# Altium project aquasense_boron1.PrjPcb
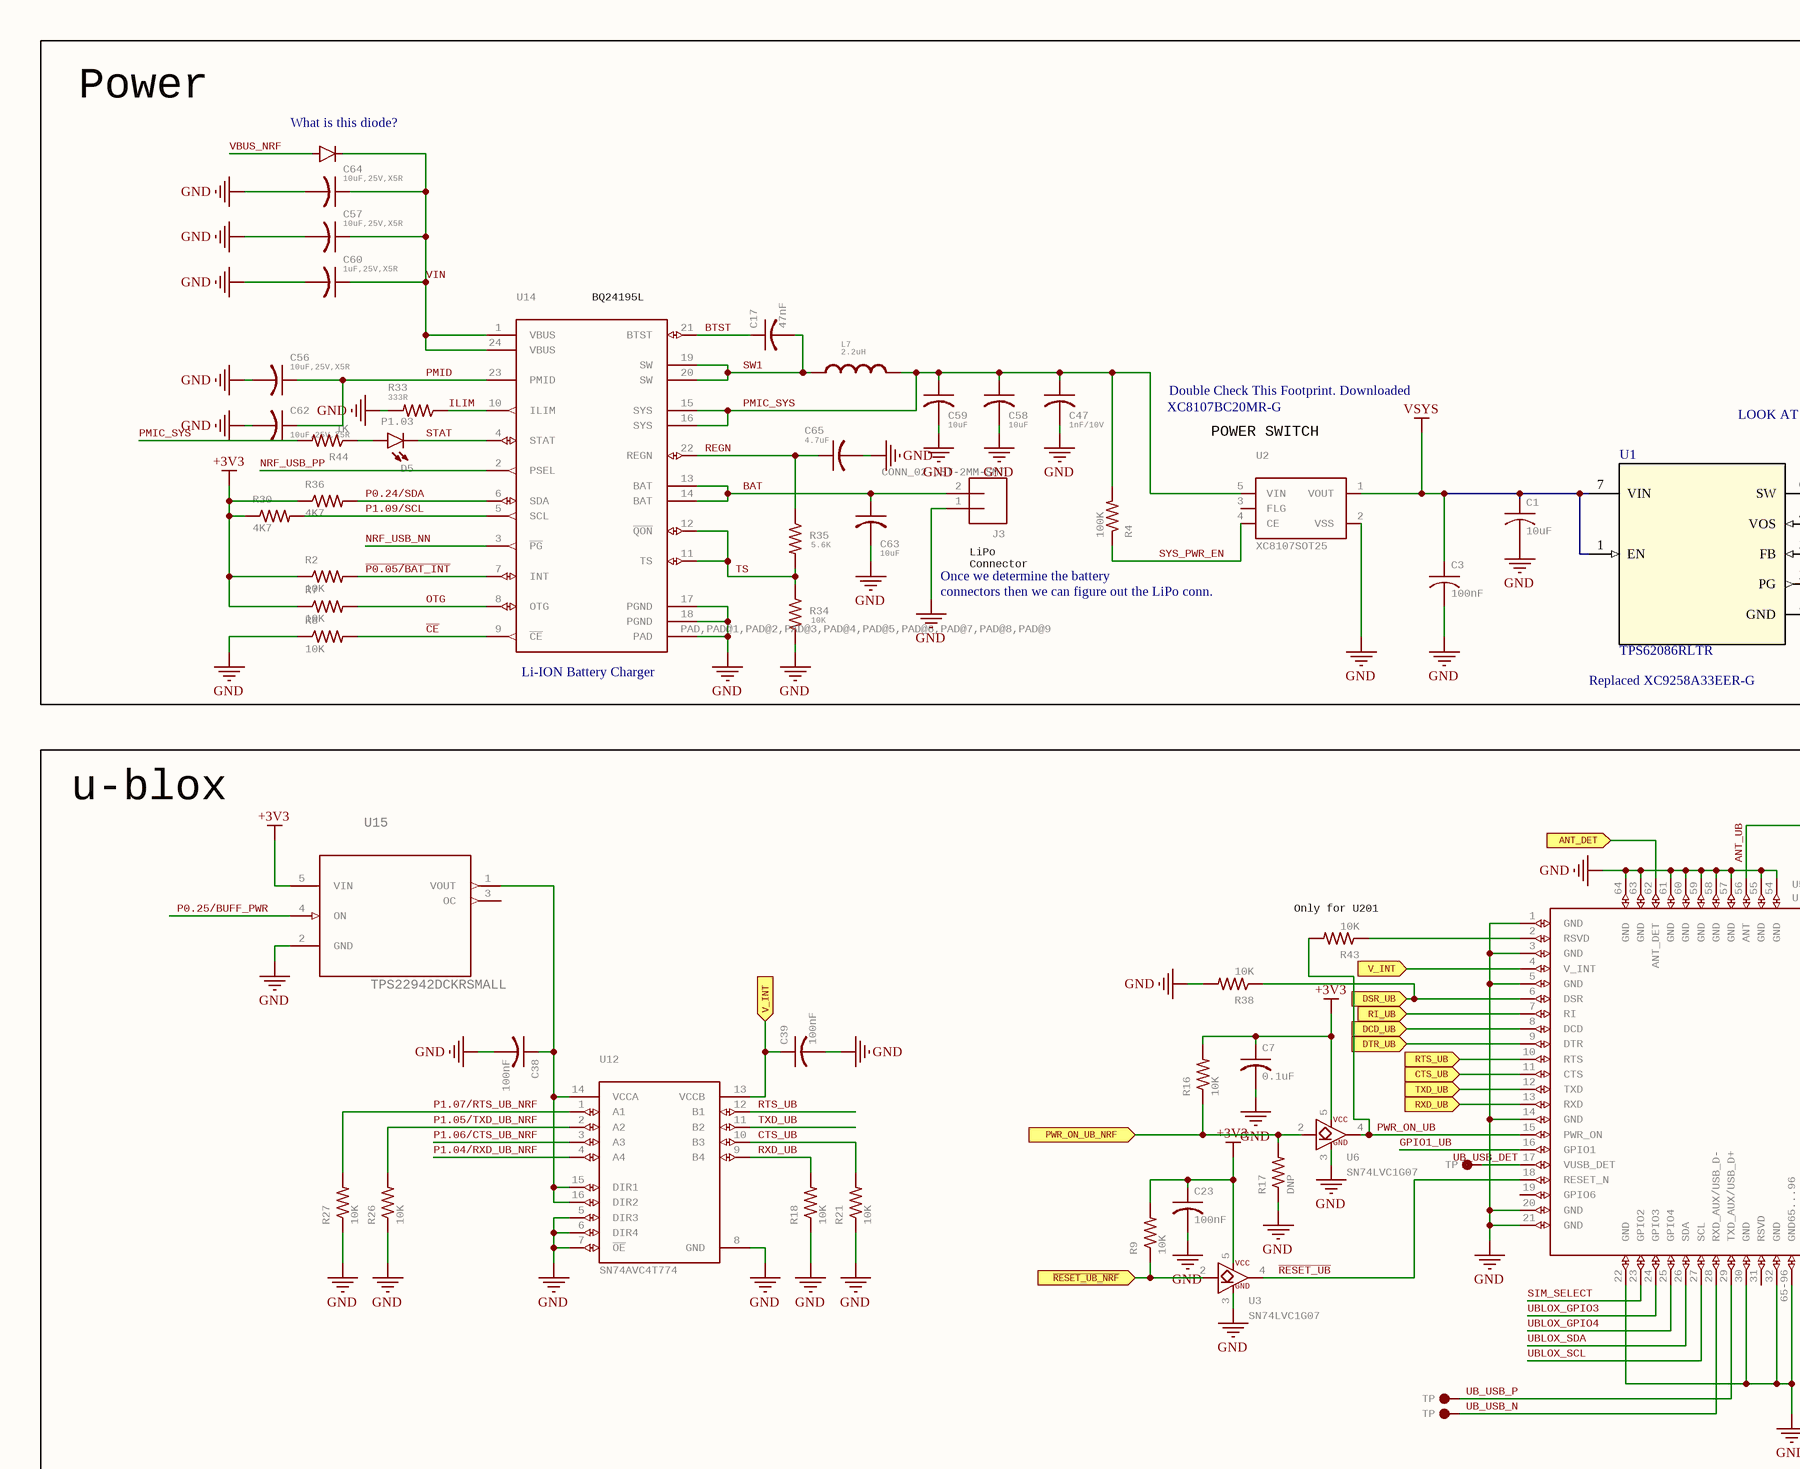
[diagram p0: aquasense_boron1.SchDoc, top left]
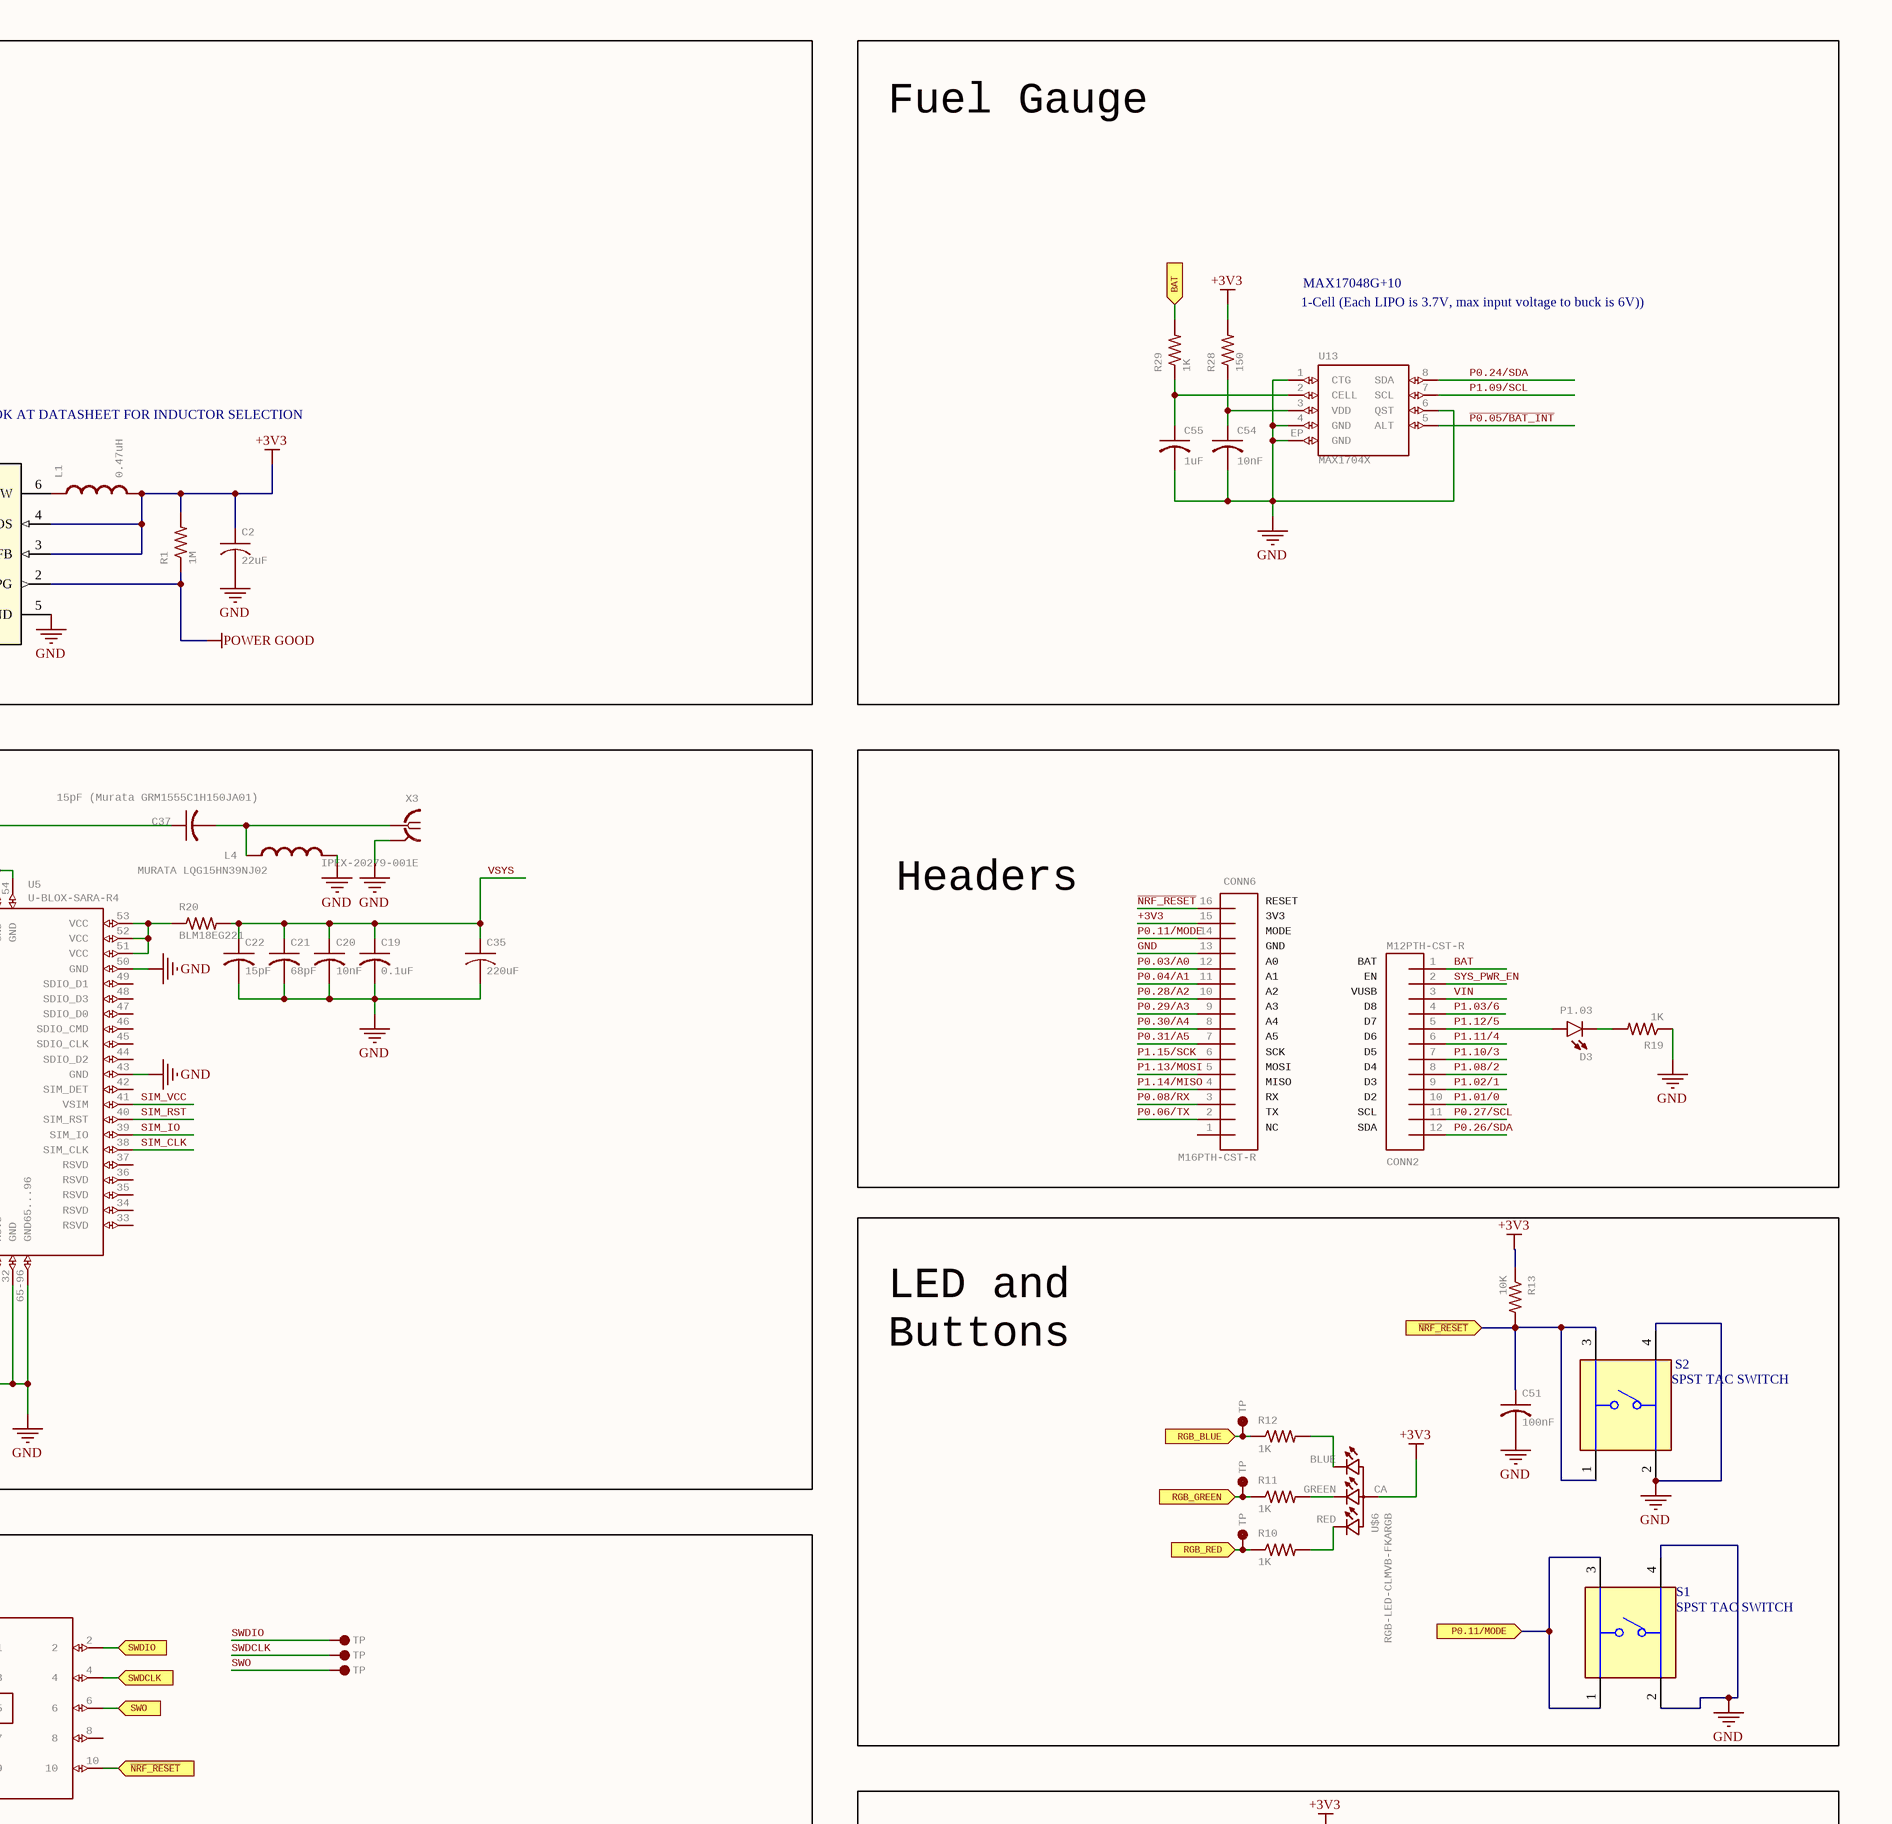
[diagram p1: aquasense_boron1.SchDoc, top right]
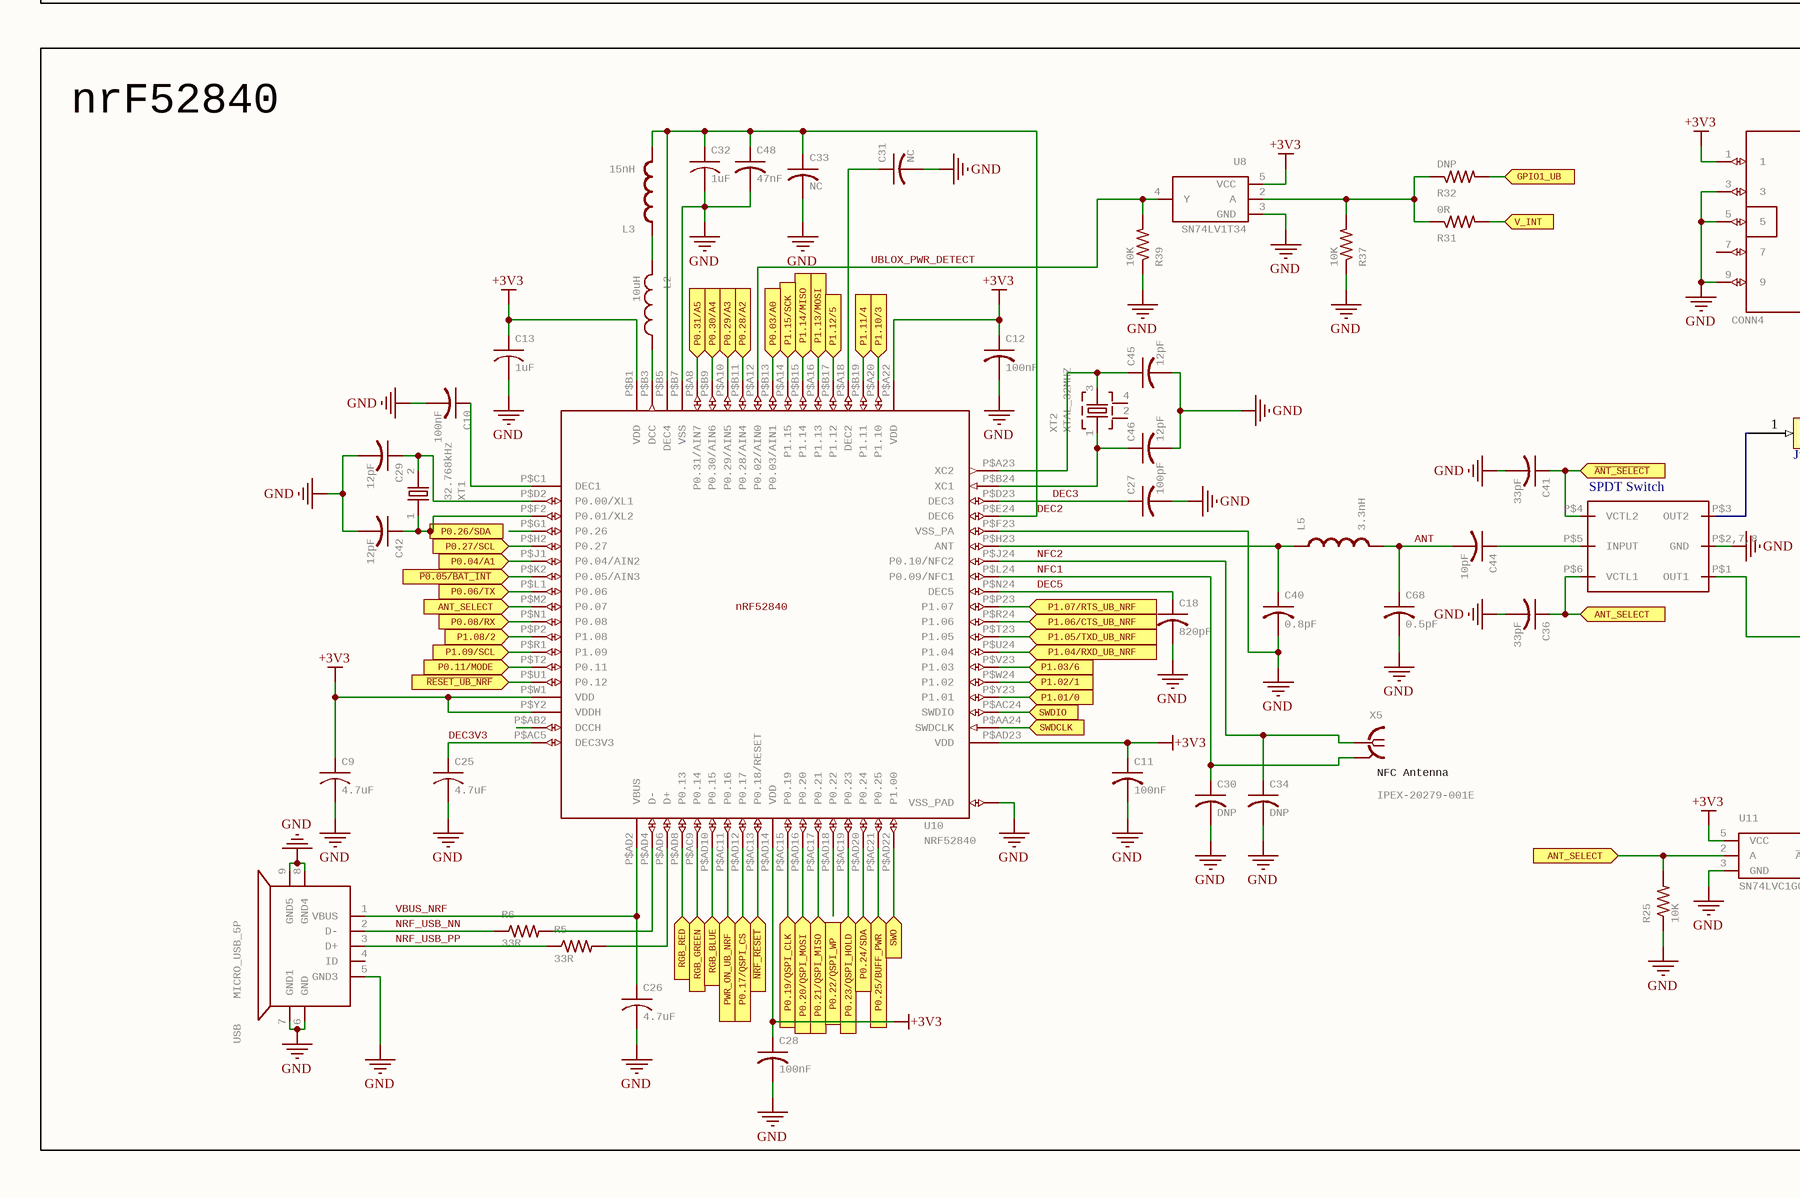
[diagram p2: aquasense_boron1.SchDoc, bottom left]
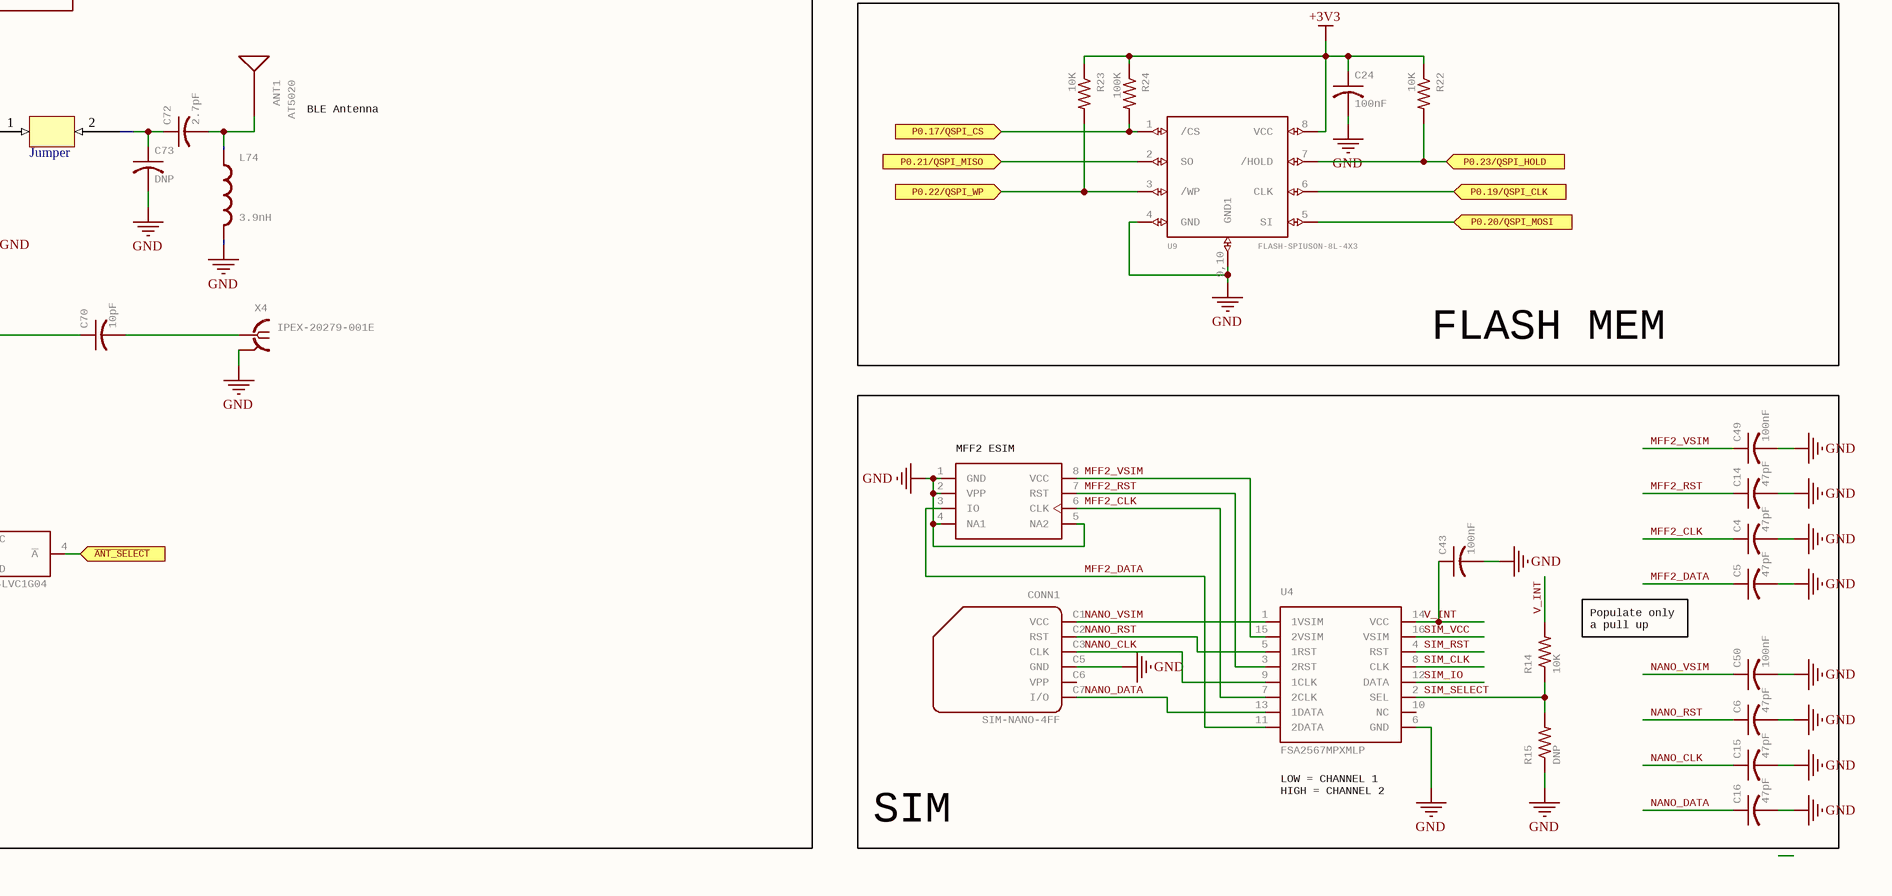
[diagram p3: aquasense_boron1.SchDoc, bottom right]
1 sheet, 156 parts. Net scope: flat (ports and power ports of the same name join across sheets).
Board file: PCB1.PcbDoc

## Sheet aquasense_boron1.SchDoc
size 622 x 458 mm; Origin: Eagle

### Parts
?  Jumper  [JUMPER]
ANT1  AT5020  [AT5020]
C1  10uF  [0805]
C2  22uF  [0805]
C3  100nF  [0805]
C4  47pF  [C0201_B]
C5  47pF  [C0201_B]
C6  47pF  [C0201_B]
C7  0.1uF  [0805]
C9  4.7uF  [0805]
C10  100nF  [0805]
C11  100nF  [0805]
C12  100nF  [0805]
C13  1uF  [0805]
C14  47pF  [C0201_B]
C15  47pF  [C0201_B]
C16  47pF  [C0201_B]
C17  47nF  [0805]
C18  820pF  [0805]
C19  0.1uF  [0805]
C20  10nF  [0805]
C21  68pF  [0805]
C22  15pF  [0805]
C23  100nF  [0805]
C24  100nF  [C0201_B]
C25  4.7uF  [0805]
C26  4.7uF  [0805]
C27  100pF  [0805]
C28  100nF  [0805]
C29  12pF  [0805]
C30  DNP  [0805]
C31  NC  [0805]
C32  1uF  [0805]
C33  NC  [0805]
C34  DNP  [0805]
C35  220uF  [0805]
C36  33pF  [0805]
C37  15pF (Murata GRM1555C1H150JA01)  [0402 Footprint]
C38  100nF  [0805]
C39  100nF  [0805]
C40  0.8pF  [0805]
C41  33pF  [0805]
C42  12pF  [0805]
C43  100nF  [C0201_B]
C44  10pF  [0805]
C45  12pF  [0805]
C46  12pF  [0805]
C47  1nF/10V  [0805]
C48  47nF  [0805]
C49  100nF  [C0201_B]
C50  100nF  [C0201_B]
C51  100nF  [0805]
C54  10nF  [0805]
C55  1uF  [0805]
C56  10uF,25V,X5R  [0805]
C57  10uF,25V,X5R  [0805]
C58  10uF  [0805]
C59  10uF  [0805]
C60  1uF,25V,X5R  [0805]
C62  10uF,25V,X5R  [0805]
C63  10uF  [0805]
C64  10uF,25V,X5R  [0805]
C65  4.7uF  [0805]
C68  0.5pF  [0805]
C70  10pF  [0805]
C72  2.7pF  [0805]
C73  DNP  [0805]
CONN1  SIM-NANO-4FF  [GCT-SIM8100]
CONN2  M12PTH-CST-R  [1X12-CASTELLATED]
CONN4  CONN5X2  [jtag header]  (value not drawn)
CONN6  M16PTH-CST-R  [1X16-CASTELLATED]
D3  P1.03  [LED-0603]
D4  DIODE_NT  [DIODE-DO-220AA_NT(SMP)]  (value not drawn)
D5  P1.03  [0805]
J3  CONN_02-JST-2MM-SMT  [JST-2-SMD@2]
L1  0.47uH  [INDUCTOR-VLS-E]
L2  10uH  [0805]
L3  15nH  [0805]
L4  MURATA LQG15HN39NJ02  [0402 Footprint]
L5  3.3nH  [IND_XFL4020-102MEC]
L7  2.2uH  [0805]
L74  3.9nH  [0805]
R1  1M  [0805]
R2  10K  [0805]
R4  100K  [0805]
R5  33R  [0805]
R6  33R  [0805]
R7  10K  [0805]
R8  10K  [0805]
R9  10K  [0805]
R10  1K  [0805]
R11  1K  [0805]
R12  1K  [0805]
R13  10K  [0805]
R14  10K  [C0201_B]
R15  DNP  [C0201_B]
R16  10K  [0805]
R17  DNP  [0805]
R18  10K  [0805]
R19  1K  [C0201_B]
R20  BLM18EG221  [BLM18EG221SN1D FERRITE BEAD]
R21  10K  [0805]
R22  10K  [C0201_B]
R23  10K  [C0201_B]
R24  100K  [C0201_B]
R25  10K  [0805]
R26  10K  [0805]
R27  10K  [0805]
R28  150  [0805]
R29  1K  [0805]
R30  4K7  [0805]
R31  0R  [0805]
R32  DNP  [0805]
R33  333R  [0805]
R34  10K  [0805]
R35  5.6K  [0805]
R36  4K7  [0805]
R37  10K  [0805]
R38  10K  [0805]
R39  10K  [0805]
R43  10K  [0805]
R44  1K  [0805]
S1  SPST TAC SWITCH  [SW_TS04-66-50-BK-260-SMT]
S2  SPST TAC SWITCH  [SW_TS04-66-50-BK-260-SMT]
U1  TPS62086RLTR  [TPS62086]
U2  XC8107SOT25  [XC8107 High Side PWR Switch]
U3  SN74LVC1G07  [BUF_Non_Invert_5_5V_SN74LVC1G07DBVR]
U4  FSA2567MPXMLP  [MLP16]
U5  U-BLOX-SARA-R4  [4GLTE_GPS_SARA-R42X_UBL]
U6  SN74LVC1G07  [BUF_Non_Invert_5_5V_SN74LVC1G07DBVR]
U7  ESIMSON8  [MFF2]  (value not drawn)
U8  SN74LV1T34  [buf_non_invert_SN74LV1T34DCKR]
U9  FLASH-SPIUSON-8L-4X3  [USON8-3X4]
U10  NRF52840  [BGA94C35P10X10_354X361X51]
U11  SN74LVC1G04  [DSF6]
U12  SN74AVC4T774  [SN74AVC4T774RGYR]
U13  MAX1704X  [MAX17048G+T10]
U14  BQ24195L  [BQ24195LRGER Batt Chg Li-Ion]
U15  TPS22942DCKRSMALL  [TPS22942DCKR]
U$1  TP5  [Test Point2]  (value not drawn)
U$4  TP5  [Test Point2]  (value not drawn)
U$5  TP5  [Test Point2]  (value not drawn)
U$6  RGB-LED-CLMVB-FKARGB  [PLCC4-2MM-RGB]
U$7  SKY13351-378LF  [SPDT_switch_SKY13351-378LF_QFN6-LF]  (value not drawn)
U$9  TP5  [Test Point2]  (value not drawn)
U$10  TP5  [Test Point2]  (value not drawn)
U$11  TP5  [Test Point2]  (value not drawn)
U$18  TP5  [Test Point2]  (value not drawn)
U$19  TP5  [Test Point2]  (value not drawn)
U$20  TP5  [TP30_TOP]  (value not drawn)
USB  MICRO_USB_5P  [USB_micro_b_CONN_10118193-0001LF_AMP]
X3  IPEX-20279-001E  [50ohm_male_ant_jack_CON3_RECE.20279.001E.01]
X4  IPEX-20279-001E  [50ohm_male_ant_jack_CON3_RECE.20279.001E.01]
X5  IPEX-20279-001E  [50ohm_male_ant_jack_CON3_RECE.20279.001E.01]
XT1  32.768kHz  [OSC_XRCGB32M768F2N10R0]
XT2  XTAL_32MHZ  [XTAL_ECS-163.84-10-36-JGN-TR]

### Blocks framed on the sheet
Power: C1-C3 C17 C47 C56-C60 C62-C65 D4 D5 J3 L1 L7 R1 R2 R4 R7 R8 R30 R33-R36 R44 U1 U2 U14
Fuel Gauge: C54 C55 R28 R29 U13
u-blox: C7 C19-C23 C35 C37-C39 L4 R9 R16-R18 R20 R21 R26 R27 R38 R43 U3 U5 U6 U12 U15 U$18-U$20 X3
Headers: CONN2 CONN6 D3 R19
nrF52840: ? ANT1 C9-C13 C18 C25-C34 C36 C40-C42 C44-C46 C48 C68 C70 C72 C73 CONN4 L2 L3 L5 L74 R5 R6 R25 R31 R32 R37 R39 U8 U10 U11 U$1 U$4 U$5 U$7 USB X4 X5 XT1 XT2
FLASH MEM: C24 R22-R24 U9
SIM: C4-C6 C14-C16 C43 C49 C50 CONN1 R14 R15 U4 U7

### Ports
ANT_DET (in), ANT_SELECT (in), BAT (in), CTS_UB (in), DCD_UB (in), DSR_UB (in), DTR_UB (in), GPIO1_UB (in), P0.03/A0 (in), P0.04/A1 (in), P0.06/TX (in), P0.08/RX (in), P0.11/MODE (in), P0.17/QSPI_CS (in), P0.19/QSPI_CLK (in), P0.20/QSPI_MOSI (in), P0.21/QSPI_MISO (in), P0.22/QSPI_WP (in), P0.23/QSPI_HOLD (in), P0.24/SDA (in), P0.25/BUFF_PWR (in), P0.26/SDA (in), P0.27/SCL (in), P0.28/A2 (in), P0.29/A3 (in), P0.30/A4 (in), P0.31/A5 (in), P1.01/0 (in), P1.02/1 (in), P1.03/6 (in), P1.04/RXD_UB_NRF (in), P1.05/TXD_UB_NRF (in), P1.06/CTS_UB_NRF (in), P1.07/RTS_UB_NRF (in), P1.08/2 (in), P1.09/SCL (in), P1.10/3 (in), P1.11/4 (in), P1.12/5 (in), P1.13/MOSI (in), P1.14/MISO (in), P1.15/SCK (in), PWR_ON_UB_NRF (in), RGB_BLUE (in), RGB_GREEN (in), RGB_RED (in), RI_UB (in), RTS_UB (in), RXD_UB (in), SWDCLK (in), SWDIO (in), SWO (in), TXD_UB (in), V_INT (in), ~{ANT_SELECT} (in), ~{NRF_RESET} (in), ~{P0.05/BAT_INT} (in), ~{RESET_UB_NRF} (in)

### Nets
+3V3: C2.1 C7.1 C9.1 C11.1 C12.1 C13.1 C23.1 C24.1 C28.1 CONN4.1 CONN6.15 L1.P$2 R1.2 R2.1 R7.1 R9.2 R13.1 R16.2 R22.1 R23.1 R24.1 R28.2 R30.1 R36.1 U1.3(FB) U1.4(VOS) U3.5(VCC) U6.5(VCC) U8.5(VCC) U9.8(VCC) U10.P$A22(VDD) U10.P$AD14(VDD) U10.P$AD23(VDD) U10.P$B1(VDD) U10.P$W1(VDD) U10.P$Y2(VDDH) U11.5(VCC) U15.5(VIN) U$6.CA
GND: C1.2 C2.2 C3.2 C4.2 C5.2 C6.2 C7.2 C9.2 C10.2 C11.2 C12.2 C13.2 C14.2 C15.2 C16.2 C18.2 C19.2 C20.2 C21.2 C22.2 C23.2 C24.2 C25.2 C26.2 C27.2 C28.2 C29.2 C30.2 C31.2 C32.2 C33.2 C34.2 C35.2 C36.2 C38.2 C39.2 C40.2 C41.2 C42.2 C43.2 C45.2 C46.2 C47.2 C48.2 C49.2 C50.2 C51.2 C54.2 C55.2 C56.2 C57.2 C58.2 C59.2 C60.2 C62.2 C63.2 C64.2 C65.2 C68.2 C73.2 CONN1.C5(GND) CONN4.3 CONN4.5 CONN4.9 CONN6.13 J3.1 L4.2 L74.2 R8.1 R15.1 R17.1 R18.1 R19.1 R21.1 R25.1 R26.1 R27.1 R33.2 R34.2 R37.1 R38.2 R39.1 S1.2 S1.4 S2.2 S2.4 U1.5(GND) U2.2(VSS) U3.3(GND) U4.6(GND) U5.1(GND) U5.3(GND) U5.5(GND) U5.14(GND) U5.20(GND) U5.21(GND) U5.22(GND) U5.30(GND) U5.32(GND) U5.43(GND) U5.50(GND) U5.54(GND) U5.55(GND) U5.57(GND) U5.58(GND) U5.59(GND) U5.60(GND) U5.61(GND) U5.63(GND) U5.64(GND) U5.65-96(GND65...96) U6.3(GND) U7.1(GND) U7.2(VPP) U7.4(NA1) U7.5(NA2) U8.3(GND) U9.4(GND) U9.9,10(GND1) U10.P$74-83(VSS_PAD) U10.P$B7(VSS) U10.P$F23(VSS_PA) U11.3(GND) U12.5(DIR3) U12.6(DIR4) U12.7(~{OE}) U12.8(GND) U13.1(CTG) U13.4(GND) U13.6(QST) U13.EP(GND) U14.17(PGND) U14.18(PGND) U14.PAD,PAD@1,PAD@2,PAD@3,PAD@4,PAD@5,PAD@6,PAD@7,PAD@8,PAD@9(PAD) U15.2(GND) U$7.P$2,7,8(GND) USB.5(GND3) USB.6(GND) USB.7(GND1) USB.8(GND4) USB.9(GND5) X3.221,22(GND) X4.221,22(GND)
POWER GOOD: R1.1 U1.2(PG)
VSYS: C1.1 C3.1 C19.1 C20.1 C21.1 C22.1 C35.1 R20.2 U1.1(EN) U1.7(VIN) U2.1(VOUT)
ANT: C44.2 C68.1 L5.2
ANT_UB: C37.1 U5.56(ANT)
BAT: C63.1 CONN2.1 J3.2 U14.13(BAT) U14.14(BAT)
BTST: C17.1 U14.21(BTST)
~{CE}: R8.2 U14.9(~{CE})
CTS_UB: R21.2 U12.10(B3)
DEC2: C32.1 C33.1 C48.1 L3.2 U10.P$B5(DEC4) U10.P$E24(DEC6)
DEC3: C27.1 U10.P$D23(DEC3)
DEC3V3: C25.1 U10.P$AC5(DEC3V3)
DEC5: C18.1 U10.P$N24(DEC5)
GPIO1_UB: U5.16(GPIO1)
ILIM: R33.1 U14.10(ILIM)
MFF2_CLK: C4.1 U4.7(2CLK) U7.6(CLK)
MFF2_DATA: C5.1 U4.11(2DATA) U7.3(IO)
MFF2_RST: C14.1 U4.3(2RST) U7.7(RST)
MFF2_VSIM: C49.1 U4.15(2VSIM) U7.8(VCC)
~{NRF_RESET}: CONN6.16
NANO_CLK: C15.1 CONN1.C3(CLK) U4.9(1CLK)
NANO_DATA: C16.1 CONN1.C7(I/O) U4.13(1DATA)
NANO_RST: C6.1 CONN1.C2(RST) U4.5(1RST)
NANO_VSIM: C50.1 CONN1.C1(VCC) U4.1(1VSIM)
NFC1: C30.1 U10.P$L24(P0.09/NFC1) X5.221,22(GND)
NFC2: C34.1 U10.P$J24(P0.10/NFC2) X5.1
NRF_USB_NN: R6.1 U14.3(~{PG}) USB.2(D-)
NRF_USB_PP: R5.1 U14.2(PSEL) USB.3(D+)
OTG: R7.2 U14.8(OTG)
P0.03/A0: CONN6.12
P0.04/A1: CONN6.11
P0.06/TX: CONN6.2
P0.08/RX: CONN6.3
P0.11/MODE: CONN6.14
P0.24/SDA: R36.2 U13.8(SDA) U14.6(SDA)
P0.25/BUFF_PWR: U15.4(ON)
P0.26/SDA: CONN2.12
P0.27/SCL: CONN2.11
P0.28/A2: CONN6.10
P0.29/A3: CONN6.9
P0.30/A4: CONN6.8
P0.31/A5: CONN6.7
P1.01/0: CONN2.10
P1.02/1: CONN2.9
P1.03/6: CONN2.4
P1.04/RXD_UB_NRF: U12.4(A4)
P1.05/TXD_UB_NRF: R26.2 U12.2(A2)
P1.06/CTS_UB_NRF: U12.3(A3)
P1.07/RTS_UB_NRF: R27.2 U12.1(A1)
P1.08/2: CONN2.8
P1.09/SCL: R30.2 U13.7(SCL) U14.5(SCL)
P1.10/3: CONN2.7
P1.11/4: CONN2.6
P1.12/5: CONN2.5 D3.A
P1.13/MOSI: CONN6.5
P1.14/MISO: CONN6.4
P1.15/SCK: CONN6.6
~{P0.05/BAT_INT}: R2.2 U13.5(ALT) U14.7(INT)
PMIC_SYS: C47.1 C58.1 C59.1 L7.P$2 R4.2 R44.2 U2.5(VIN) U14.15(SYS) U14.16(SYS)
PMID: C56.1 C62.1 U14.23(PMID)
PWR_ON_UB: R43.2 U5.15(PWR_ON) U6.4(B)
~{RESET_UB}: U3.4(B) U5.18(RESET_N)
REGN: C65.1 R35.1 U14.22(REGN)
RTS_UB: U12.12(B1)
RXD_UB: R18.2 U12.9(B4)
SIM_CLK: U4.8(CLK) U5.38(SIM_CLK)
SIM_IO: U4.12(DATA) U5.39(SIM_IO)
SIM_RST: U4.4(RST) U5.40(SIM_RST)
SIM_SELECT: R14.1 R15.2 U4.2(SEL) U5.23(GPIO2)
SIM_VCC: U4.16(VSIM) U5.41(VSIM)
STAT: D5.C U14.4(STAT)
SW1: C17.2 L7.P$1 U14.19(SW) U14.20(SW)
SWDCLK: U$4.P$1(TP)
SWDIO: U$1.P$1(TP)
SWO: U$5.P$1(TP)
SYS_PWR_EN: CONN2.2 R4.1 U2.4(CE)
TS: R34.1 R35.2 U14.11(TS) U14.12(~{QON})
TXD_UB: U12.11(B2)
UB_USB_DET: U5.17(VUSB_DET) U$20.P$1(TP)
UB_USB_N: U5.28(RXD_AUX/USB_D-) U$19.P$1(TP)
UB_USB_P: U5.29(TXD_AUX/USB_D+) U$18.P$1(TP)
UBLOX_GPIO3: U5.24(GPIO3)
UBLOX_GPIO4: U5.25(GPIO4)
UBLOX_PWR_DETECT: R39.2 U8.4(Y) U10.P$A12(P0.02/AIN0)
UBLOX_SCL: U5.27(SCL)
UBLOX_SDA: U5.26(SDA)
V_INT: C43.1 R14.2 U4.14(VCC)
VBUS_NRF: C26.1 D4.ANODE U10.P$AD2(VBUS) USB.1(VBUS)
VIN: C57.1 C60.1 C64.1 CONN2.3 D4.CATHODE U14.1(VBUS) U14.24(VBUS)
Net?_1: ?.1 U$7.P$3(OUT2)
Net?_2: ?.2 C72.1 C73.1
NetANT1_1: ANT1.1(SIGNAL) C72.2 L74.1
NetC10_1: C10.1 U10.P$C1(DEC1)
NetC29_1: C29.1 U10.P$D2(P0.00/XL1) XT1.2
NetC31_1: C31.1 U10.P$A18(DEC2)
NetC36_1: C36.1 R25.2 U10.P$M2(P0.07) U11.2(A) U$7.P$6(VCTL1) ; port ANT_SELECT
NetC37_2: C37.2 L4.1 X3.1
NetC38_1: C38.1 U12.14(VCCA) U12.15(DIR1) U12.16(DIR2) U15.1(VOUT)
NetC39_1: C39.1 R31.2 U5.4(V_INT) U12.13(VCCB) ; port V_INT
NetC40_1: C40.1 L5.1 U10.P$H23(ANT)
NetC41_1: C41.1 U11.4(~{A}) U$7.P$4(VCTL2) ; port ~{ANT_SELECT}
NetC42_1: C42.1 U10.P$F2(P0.01/XL2) XT1.1 ; port P0.26/SDA
NetC44_1: C44.1 U$7.P$5(INPUT)
NetC45_1: C45.1 U10.P$A23(XC2) XT2.3
NetC46_1: C46.1 U10.P$B24(XC1) XT2.1
NetC51_1: C51.1 CONN4.10 R13.2 S2.1 S2.3 U10.P$AC13(P0.18/RESET) ; port ~{NRF_RESET}
NetC54_1: C54.1 R28.1 U13.3(VDD)
NetC55_1: C55.1 R29.1 U13.2(CELL)
NetC70_1: C70.1 U$7.P$1(OUT1)
NetC70_2: C70.2 X4.1
NetCONN4_2: CONN4.2 U10.P$AC24(SWDIO) ; port SWDIO
NetCONN4_4: CONN4.4 U10.P$AA24(SWDCLK) ; port SWDCLK
NetCONN4_6: CONN4.6 U10.P$AD22(P1.00) ; port SWO
NetD3_C: D3.C R19.2
NetD5_A: D5.A R44.1
NetL1_P$1: L1.P$1 U1.6(SW)
NetL2_1: L2.1 U10.P$B3(DCC)
NetL2_2: L2.2 L3.1
NetR5_2: R5.2 U10.P$AD6(D+)
NetR6_2: R6.2 U10.P$AD4(D-)
NetR9_1: R9.1 U3.2(A) U10.P$U1(P0.12) ; port ~{RESET_UB_NRF}
NetR10_1: R10.1 U10.P$AD8(P0.13) U$9.P$1(TP) ; port RGB_RED
NetR10_2: R10.2 U$6.RED
NetR11_1: R11.1 U10.P$AC9(P0.14) U$10.P$1(TP) ; port RGB_GREEN
NetR11_2: R11.2 U$6.GREEN
NetR12_1: R12.1 U10.P$AD10(P0.15) U$11.P$1(TP) ; port RGB_BLUE
NetR12_2: R12.2 U$6.BLUE
NetR16_1: R16.1 R17.2 U6.2(A) U10.P$AC11(P0.16) ; port PWR_ON_UB_NRF
NetR20_1: R20.1 U5.51(VCC) U5.52(VCC) U5.53(VCC)
NetR22_2: R22.2 U9.7(/HOLD) U10.P$AC19(P0.23) ; port P0.23/QSPI_HOLD
NetR23_2: R23.2 U9.3(/WP) ; port P0.22/QSPI_WP
NetR24_2: R24.2 U9.1(/CS) U10.P$AD12(P0.17) ; port P0.17/QSPI_CS
NetR29_2: R29.2 ; port BAT
NetR31_1: R31.1 R32.1 R37.2 U8.2(A)
NetR32_2: R32.2 ; port GPIO1_UB
NetR38_1: R38.1 U5.6(DSR) ; port DSR_UB
NetR43_1: R43.1 U5.2(RSVD)
NetS1_1: S1.1 S1.3 U10.P$T2(P0.11) ; port P0.11/MODE
NetU5_7: U5.7(RI) ; port RI_UB
NetU5_8: U5.8(DCD) ; port DCD_UB
NetU5_9: U5.9(DTR) ; port DTR_UB
NetU5_10: U5.10(RTS) ; port RTS_UB
NetU5_11: U5.11(CTS) ; port CTS_UB
NetU5_12: U5.12(TXD) ; port TXD_UB
NetU5_13: U5.13(RXD) ; port RXD_UB
NetU5_62: U5.62(ANT_DET) ; port ANT_DET
NetU9_2: U9.2(SO) U10.P$AC17(P0.21) ; port P0.21/QSPI_MISO
NetU9_5: U9.5(SI) U10.P$AD16(P0.20) ; port P0.20/QSPI_MOSI
NetU9_6: U9.6(CLK) U10.P$AC15(P0.19) ; port P0.19/QSPI_CLK
NetU10_P$A8: U10.P$A8(P0.31/AIN7) ; port P0.31/A5
NetU10_P$A10: U10.P$A10(P0.29/AIN5) ; port P0.29/A3
NetU10_P$A14: U10.P$A14(P1.15) ; port P1.15/SCK
NetU10_P$A16: U10.P$A16(P1.13) ; port P1.13/MOSI
NetU10_P$A20: U10.P$A20(P1.10) ; port P1.10/3
NetU10_P$AC21: U10.P$AC21(P0.25) ; port P0.25/BUFF_PWR
NetU10_P$AD20: U10.P$AD20(P0.24) ; port P0.24/SDA
NetU10_P$B9: U10.P$B9(P0.30/AIN6) ; port P0.30/A4
NetU10_P$B11: U10.P$B11(P0.28/AIN4) ; port P0.28/A2
NetU10_P$B13: U10.P$B13(P0.03/AIN1) ; port P0.03/A0
NetU10_P$B15: U10.P$B15(P1.14) ; port P1.14/MISO
NetU10_P$B17: U10.P$B17(P1.12) ; port P1.12/5
NetU10_P$B19: U10.P$B19(P1.11) ; port P1.11/4
NetU10_P$H2: U10.P$H2(P0.27) ; port P0.27/SCL
NetU10_P$J1: U10.P$J1(P0.04/AIN2) ; port P0.04/A1
NetU10_P$K2: U10.P$K2(P0.05/AIN3) ; port ~{P0.05/BAT_INT}
NetU10_P$L1: U10.P$L1(P0.06) ; port P0.06/TX
NetU10_P$N1: U10.P$N1(P0.08) ; port P0.08/RX
NetU10_P$P2: U10.P$P2(P1.08) ; port P1.08/2
NetU10_P$P23: U10.P$P23(P1.07) ; port P1.07/RTS_UB_NRF
NetU10_P$R1: U10.P$R1(P1.09) ; port P1.09/SCL
NetU10_P$R24: U10.P$R24(P1.06) ; port P1.06/CTS_UB_NRF
NetU10_P$T23: U10.P$T23(P1.05) ; port P1.05/TXD_UB_NRF
NetU10_P$U24: U10.P$U24(P1.04) ; port P1.04/RXD_UB_NRF
NetU10_P$V23: U10.P$V23(P1.03) ; port P1.03/6
NetU10_P$W24: U10.P$W24(P1.02) ; port P1.02/1
NetU10_P$Y23: U10.P$Y23(P1.01) ; port P1.01/0

Not connected (* = marked no-connect by the designer): CONN1 C6(VPP); CONN4 7 8; CONN6 1; U2 3(FLG); U4 10(NC); U5 19(GPIO6) 31(RSVD) 33(RSVD) 34(RSVD) 35(RSVD) 36(RSVD) 37(RSVD) 42(SIM_DET) 44(SDIO_D2) 45(SDIO_CLK) 46(SDIO_CMD) 47(SDIO_D0) 48(SDIO_D3) 49(SDIO_D1); U10 P$AB2(DCCH) P$AD18(P0.22) P$G1(P0.26); U15 3(OC); USB 4(ID); XT2 2 4

### Notes on the sheet
- (near D4) What is this diode?
- 1-Cell (Each LIPO is 3.7V, max input voltage to buck is 6V))
- MAX17048G+10
- Double Check This Footprint. Downloaded
- XC8107BC20MR-G
- (near U2) POWER SWITCH
- LOOK AT DATASHEET FOR INDUCTOR SELECTION
- Once we determine the battery
- connectors then we can figure out the LiPo conn.
- (near J3) LiPo
  Connector
- (near U14) Li-ION Battery Charger
- (near U1) Replaced XC9258A33EER-G
- (near R43) Only for U201
- (near CONN6) 3V3
- (near CONN6) RESET
- (near CONN6) A2
- (near CONN6) A1
- (near CONN6) A0
- (near CONN6) GND
- (near CONN6) MODE
- (near CONN2) VUSB
- (near CONN2) EN
- (near CONN2) BAT
- (near CONN6) MOSI
- (near CONN6) SCK
- (near CONN6) A5
- (near CONN6) A4
- (near CONN6) A3
- (near CONN2) D4
- (near CONN2) D5
- (near CONN2) D6
- (near CONN2) D7
- (near CONN2) D8
- (near CONN6) NC
- (near CONN6) TX
- (near CONN6) RX
- (near CONN6) MISO
- (near CONN2) SDA
- (near CONN2) SCL
- (near CONN2) D2
- (near CONN2) D3
- LED and
  Buttons
- (near ANT1) BLE Antenna
- (near U$7) SPDT Switch
- (near X5) NFC Antenna
- (near U7) MFF2 ESIM
- Populate only
  a pull up
- (near U4) LOW = CHANNEL 1
  HIGH = CHANNEL 2

### Library data of the parts
ANT1 = AT5020: AT5020 Series 2.4GHz Multilayer Chip Antenna for Wi-Fi, Bluetooth, etc..; GateName_1: G$1; SymbolName_1: ANTENNA; LibraryName: Particle; DeviceSetName: AT5020
C1-C3 = C-USC0603K: CAPACITOR, American symbol; GateName_1: G$1; SymbolName_1: C-US; DeviceName: C0603K; LibraryName: rcl; DeviceSetName: C-US
C4-C6 C10-C12 C14-C18 C23 C24 C27-C31 C33 C34 C36 C38-C46 C48-C51 C68 C70 C72 C73 = C-USC0201_B: Capacitor; GateName_1: C1; SymbolName_1: C-US; DeviceName: C0201_B; LibraryName: Particle; DeviceSetName: C-US
C7 C19-C22 C37 C54 C55 = C-US: Capacitor; GateName_1: G$1; SymbolName_1: C-US; LibraryName: Spark; DeviceSetName: C-US
C9 C13 C25 C26 = C-USC0402: CAPACITOR, American symbol; GateName_1: G$1; SymbolName_1: C-US; DeviceName: C0402; LibraryName: rcl; DeviceSetName: C-US
C32 = C-USC0402K: CAPACITOR, American symbol; GateName_1: G$1; SymbolName_1: C-US; DeviceName: C0402K; LibraryName: rcl; DeviceSetName: C-US
C35 = C-USC1210: CAPACITOR, American symbol; GateName_1: G$1; SymbolName_1: C-US; DeviceName: C1210; LibraryName: rcl; DeviceSetName: C-US
C47 = C-US0402: Capacitor; GateName_1: G$1; SymbolName_1: C-US; DeviceName: 0402; LibraryName: Bretts-Spark-Library; DeviceSetName: C-US
C56-C60 C62-C65 = C-US0603: Capacitor; GateName_1: G$1; SymbolName_1: C-US; DeviceName: 0603; LibraryName: Bretts-Spark-Library; DeviceSetName: C-US
CONN1 = SIM-NANO-4FF: SIM NANO 4FF; GateName_1: G$1; SymbolName_1: SIM-NANO-4FF; LibraryName: Particle; DeviceSetName: SIM-NANO-4FF
CONN2 = M12PTH-CST-R: Header 12Standard 12-pin 0.1" header. Use with straight break away headers (SKU : PRT-00116), right angle break away headers (PRT-00553), swiss pins (PRT-00743), machine pins (PRT-00117), and female headers (PRT-00115).; GateName_1: CONN1; SymbolName_1: M12; DeviceName: PTH-CST-R; LibraryName: Particle; DeviceSetName: M12
CONN4 = CONN5X2: 5x2 pin JTAG connector for Particle mesh dev kits; GateName_1: CONN1; SymbolName_1: CONN5X2; LibraryName: Particle; DeviceSetName: CONN5X2
CONN6 = M16PTH-CST-R: GateName_1: CONN1; SymbolName_1: M16; DeviceName: PTH-CST-R; LibraryName: Particle; DeviceSetName: M16
D3 D5 = LED-RED0603: Red SMD LED    Used in manufacturing of most products at SparkFun   Packages: 0603 - SMD 0603 package [Product Link]  0603 SMART - SMD 0603 SMART package ( more efficient and expensive)[Product Link]   1206 - SMD1206  package [Product Link]    SparkFun Products: Pro Mini 328 -5V  RedBoard  IOIO-OTG; GateName_1: G$1; DeviceName: 0603; PROD_ID: DIO-00819; SymbolName_1: LED; LibraryName: SparkFun-LED; DeviceSetName: LED-RED
D4 = DIODE_NT: GateName_1: G$1; SymbolName_1: DIODE; DeviceName: _NT; LibraryName: Particle; DeviceSetName: DIODE
J3 = CONN_02-JST-2MM-SMT: Multi connection point. Often used as Generic Header-pin footprint for 0.1 inch spaced/style header connections    On any of the 0.1 inch spaced packages, you can populate with these:  Break Away Headers - Straight (PRT-00116)   Break Away Male Headers - Right Angle (PRT-00553)   Female Headers (PRT-00115)   Break Away Headers - Machine Pin (PRT-00117)   Break Away Female Headers - Swiss Machine Pin (PRT-00743)        For SCREWTERMINALS and SPRING TERMINALS visit here:  Screw Terimnals on SparkFun.com (5mm/3.5mm/2.54mm spacing)       This device is also useful as a general connection point to wire up your design to another part of your project. Our various solder wires solder well into these plated through hole pads.  Hook-Up Wire - Assortment (Stranded, 22 AWG) (PRT-11375)   Hook-Up Wire - Assortment (Solid Core, 22 AWG) (PRT-11367)   View the entire wire category on our website here          Special notes: Molex polarized connector foot print use with: PRT-08233 with associated crimp pins and housings.  2.54_SCREWTERM for use with  PRT-10571.  3.5mm Screw Terminal footprints for  PRT-08084  5mm Screw Terminal footprints for use with PRT-08432; GateName_1: G$1; PROD_ID: CONN-11443; SymbolName_1: CONN_02; DeviceName: -JST-2MM-SMT; LibraryName: SparkFun-Connectors; DeviceSetName: CONN_02
L1 = INDUCTOR-SPARKFUNVLS3012ET-4R7M: Inductors   Basic Inductor/Choke - 0603 and 1206. Footprints are not proven and vary greatly between part numbers. SRN6045- 33uH, 20% 1.4A; GateName_1: G$1; SymbolName_1: INDUCTOR-1; DeviceName: VLS3012ET-4R7M; LibraryName: Particle; DeviceSetName: INDUCTOR-SPARKFUN
L2 = INDUCTOR_0603_L: Generic chip inductor; GateName_1: L$1; SymbolName_1: L-US; DeviceName: _0603_L; LibraryName: Nordic_nRF; DeviceSetName: INDUCTOR
L3-L5 L74 = INDUCTOR-0402: GateName_1: G$1; SymbolName_1: INDUCTOR-1; LibraryName: Particle; DeviceSetName: INDUCTOR-0402
L7 = INDUCTORI: GateName_1: G$1; SymbolName_1: INDUCTOR-1; DeviceName: I; LibraryName: Particle; DeviceSetName: INDUCTOR
R1 R2 R4-R19 R21-R27 R30-R32 R36-R39 R43 R44 = R-US_R0201_B: 0402 Resistor; GateName_1: R1; SymbolName_1: R-US_; DeviceName: R0201_B; LibraryName: Particle; DeviceSetName: R-US_
R20 = R-US_R0603: RESISTOR, American symbol; GateName_1: G$1; SymbolName_1: R-US; DeviceName: R0603; DeviceSetName: R-US_; LibraryName: rcl
R28 R29 = RESISTOR0402-RES: ResistorBasic schematic elements and footprints for 0603, 1206, and PTH resistors.; GateName_1: G$1; SymbolName_1: RESISTOR; DeviceName: 0402-RES; LibraryName: SparkFun-Passives; DeviceSetName: RESISTOR
R33-R35 = R-US_: 0402 Resistor; GateName_1: G$1; SymbolName_1: R-US_; LibraryName: Spark; DeviceSetName: R-US_
S1 S2 = TS04-66-50-BK-260-SMT: TAC_SWITCH_SPST_SW_TS04-66-50-BK-260-SMT; Value: *; MP: TS04-66-50-BK-260-SMT; Package: None; Availability: Unavailable; Price: None
U1 = TPS62086RLTR: No Description Available; Mfr_Name: Texas Instruments; CompType: IC; TYPE: TYPE; RefDes: RefDes; PartNumber: TPS62086RLTR; PackageReference: RLT0007A; MountType: SMT; RoHS: Y; Manufacturer: Texas Instruments
U2 = XC8107SOT25: GateName_1: U1; SymbolName_1: XC8107; DeviceName: SOT25; LibraryName: Particle; DeviceSetName: XC8107
U3 U6 = SN74LVC1G07: GateName_1: G$1; SymbolName_1: SN74LVC1G07; LibraryName: Particle; DeviceSetName: SN74LVC1G07; VCC: VCC; GND: GND
U4 = FSA2567MPXMLP: Low power dual SIM card analog switch; GateName_1: U1; DeviceName: MLP; SymbolName_1: FSA2567MPX; LibraryName: Particle; DeviceSetName: FSA2567MPX
U5 = U-BLOX-SARA-R4: ublox SARA-R4 series LTE CATm1/ NB1 modules; GateName_1: G$1; SymbolName_1: U-BLOX-SARA-R4; LibraryName: Particle; DeviceSetName: U-BLOX-SARA-R4
U7 = ESIMSON8: GateName_1: G$1; SymbolName_1: ESIM; DeviceName: SON8; LibraryName: Particle; DeviceSetName: ESIM
U8 = SN74LV1T34: Texas Instruments Single Power Supply Single Buffer GATE CMOS Logic Level Shifter; GateName_1: U1; SymbolName_1: SN74LV1T34; LibraryName: Particle; DeviceSetName: SN74LV1T34
U9 = FLASH-SPIUSON-8L-4X3: GateName_1: G$1; SymbolName_1: MX25L1606EZUI; DeviceName: USON-8L-4X3; LibraryName: particle SZ; DeviceSetName: FLASH-SPI
U10 = NRF52840: nRF52840      Features  Advanced Single chip 2.4 GHz multi-protocol SoC  32-bit ARM Cortex-M4F Processor  1.7v to 5.5v operation  1MB flash + 256kB RAM  Bluetooth 5 support for long range and high throughput  802.15.4 radio support  On-chip NFC   PPI â€“Programmable Peripheral Interconnect  Automated power management system with automatic power management of each peripheral  Configurable I/O mapping for analog and digital I/O  48 x GPIO  1 x QSPI  4 x Master/Slave SPI  2 x Two-wire interface (IÂ²C)  IÂ²S interface  2 x UART   4 x PWM  USB 2.0 controller  ARM TrustZone CryptoCell-310 Cryptographic and security module  AES 128-bit ECB/CCM/AAR hardware accelerator  Digital microphone interface (PDM)  Quadrature decoder  12-bit ADC  Low power comparator  On-chip 50Î© balun  On-air compatible with nRF52, nRF51 and nRF24 Series      Applications  Advanced high performance wearables  Wearables for secure payments  Virtual Reality/Augmented Reality systems  Smart Home sensor networks  Smart city sensor networks  High performance HID controllers  Internet of Things (IoT) sensor networks  Smart door locks  Smart lighting networks  Connected white goods; GateName_1: G$1; SymbolName_1: NRF52840; LibraryName: Nordic_nRF; DeviceSetName: NRF52840; nRF52840: nRF52840
U11 = SN74LVC1G04: Texas Instruments Single Inverter Gate; GateName_1: U1; SymbolName_1: SN74LVC1G04; LibraryName: Particle; DeviceSetName: SN74LVC1G04
U12 = SN74AVC4T774: GateName_1: U1; SymbolName_1: SN74AVC4T774; LibraryName: Particle; DeviceSetName: SN74AVC4T774
U13 = MAX1704X: MAX17043/MAX17044: Battery Fuel Guage (43 is 1cell, 44 is 2cell); GateName_1: G$1; SymbolName_1: MAX1704X; LibraryName: SparkFun-PowerIC; DeviceSetName: MAX1704X
U14 = BQ24298RTWR: Bq24298 I2C Controlled 3A Single Cell USB Charger with Narrow VDC Power Path Management and Adjustable Voltage USB OTG; GateName_1: G$1; SymbolName_1: BQ24298; LibraryName: electron; DeviceSetName: BQ24298RTWR
U15 = TPS22942DCKRSMALL: LOAD SWITCHES; GateName_1: A; DeviceName: SMALL; SymbolName_1: TPS22942DCKR; LibraryName: Texas Instruments_By_element14_Batch_1; DeviceSetName: TPS22942DCKR
U$1 U$4 U$5 U$9-U$11 U$18-U$20 = TP5: Test Points of all sizes and shapes; GateName_1: G$1; SymbolName_1: TESTPAD; DeviceName: 5; DeviceSetName: TP; LibraryName: Particle; TP: TP
U$6 = RGB-LED-CLMVB-FKARGB: CREE CLMVB-FKA RGB LED 2mm x 2mm; GateName_1: G$1; SymbolName_1: LED-RGB2; DeviceName: RGB; LibraryName: Particle; DeviceSetName: RGB-LED-CLMVB-FKA
U$7 = SKY13351-378LF: GateName_1: G$1; SymbolName_1: SKY13351-378LF; LibraryName: particle SZ; DeviceSetName: SKY13351-378LF
USB = MICRO_USBMICRO_USB: Micro-USB; GateName_1: G$1; SymbolName_1: MICRO_USB; DeviceName: MICRO_USB; LibraryName: RedBear; DeviceSetName: MICRO_USB
X3-X5 = IPEX-20279-001E: Ultra Miniature Coaxial SMT RF Receptacle; GateName_1: G$1; SymbolName_1: BNC-F2; DeviceSetName: IPEX-20279-001E
  X3: LibraryName: Spark
  X4 X5: LibraryName: Particle
XT1 = XTAL_32KHZ: GateName_1: X$1; SymbolName_1: XTAL; LibraryName: Nordic_nRF; DeviceSetName: XTAL_32KHZ
XT2 = XTAL_32MHZ: GateName_1: X$1; SymbolName_1: XTAL_GND; LibraryName: Nordic_nRF; DeviceSetName: XTAL_32MHZ